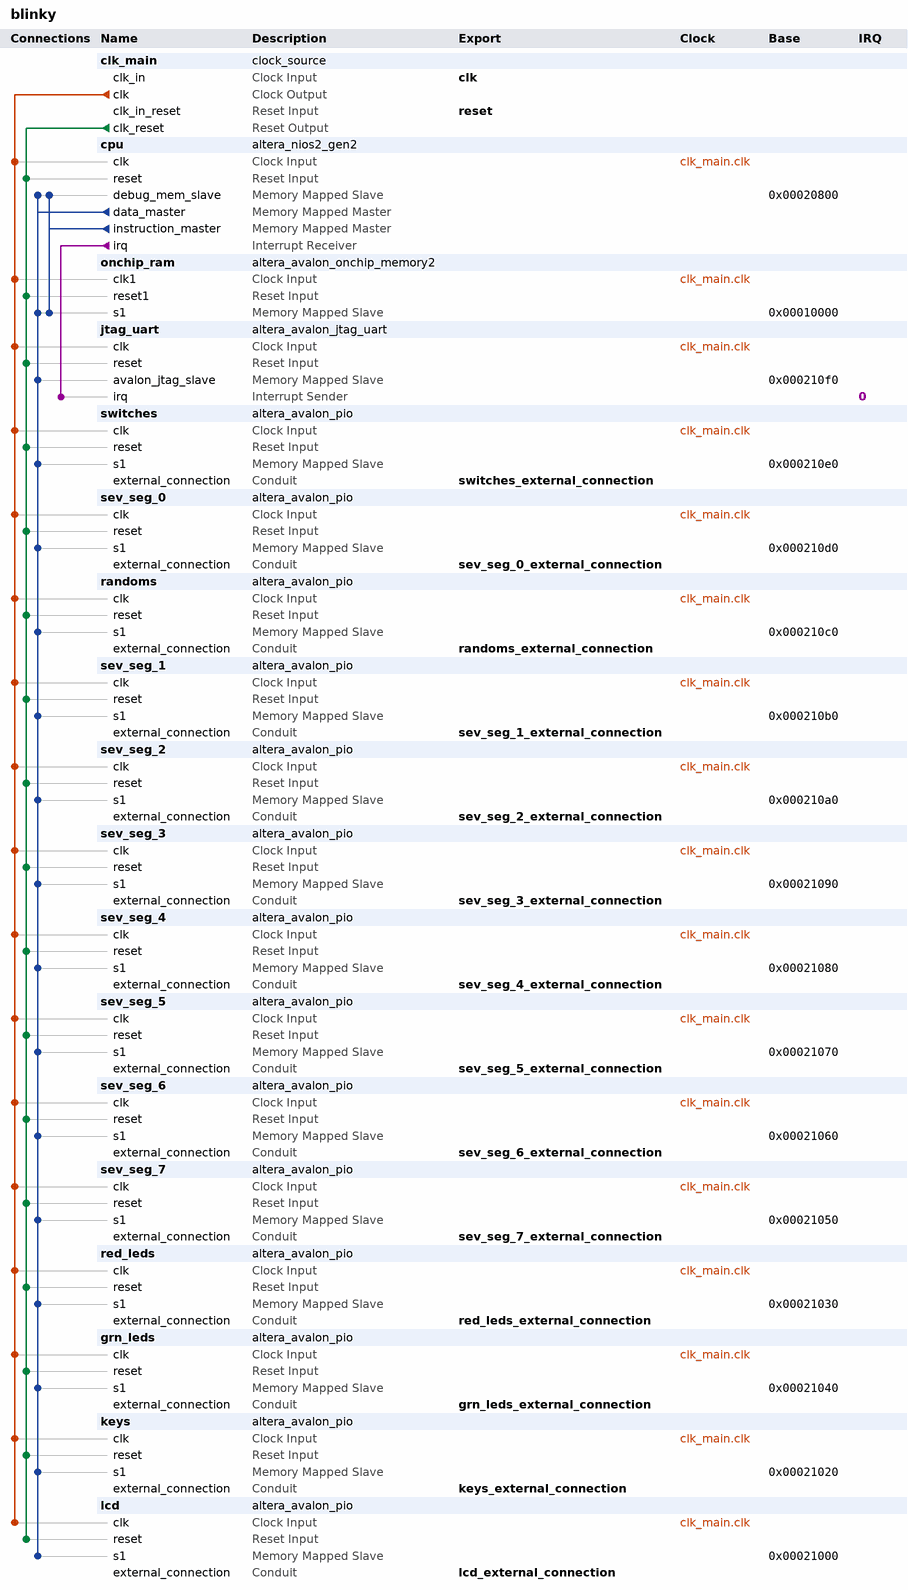
[diagram p0: system contents]
# Platform Designer (Qsys) system blinky, Cyclone IV E EP4CE115F29C7
# Parameters at their usual value, and those the tool derives, are not listed.
package require -exact qsys 18.0
create_system blinky
set_project_property DEVICE_FAMILY {Cyclone IV E}
set_project_property DEVICE EP4CE115F29C7

add_instance clk_main clock_source 18.0
set_instance_parameter_value clk_main clockFrequency 50000000

add_instance cpu altera_nios2_gen2 18.0
set_instance_parameter_value cpu dcache_size 2048
set_instance_parameter_value cpu exceptionSlave onchip_ram.s1
set_instance_parameter_value cpu icache_size 4096
set_instance_parameter_value cpu impl Tiny
set_instance_parameter_value cpu resetSlave onchip_ram.s1

add_instance onchip_ram altera_avalon_onchip_memory2 18.0
set_instance_parameter_value onchip_ram dataWidth 32
set_instance_parameter_value onchip_ram dualPort false
set_instance_parameter_value onchip_ram initMemContent false
set_instance_parameter_value onchip_ram initializationFileName onchip_mem.hex
set_instance_parameter_value onchip_ram memorySize 65536

add_instance jtag_uart altera_avalon_jtag_uart 18.0
set_instance_parameter_value jtag_uart simInteractiveOptions NO_INTERACTIVE_WINDOWS

add_instance switches altera_avalon_pio 18.0
set_instance_parameter_value switches direction Input
set_instance_parameter_value switches width 18

add_instance sev_seg_0 altera_avalon_pio 18.0
set_instance_parameter_value sev_seg_0 direction Output
set_instance_parameter_value sev_seg_0 width 7

add_instance randoms altera_avalon_pio 18.0
set_instance_parameter_value randoms direction Input
set_instance_parameter_value randoms width 32

add_instance sev_seg_1 altera_avalon_pio 18.0
set_instance_parameter_value sev_seg_1 direction Output
set_instance_parameter_value sev_seg_1 width 7

add_instance sev_seg_2 altera_avalon_pio 18.0
set_instance_parameter_value sev_seg_2 direction Output
set_instance_parameter_value sev_seg_2 width 7

add_instance sev_seg_3 altera_avalon_pio 18.0
set_instance_parameter_value sev_seg_3 direction Output
set_instance_parameter_value sev_seg_3 width 7

add_instance sev_seg_4 altera_avalon_pio 18.0
set_instance_parameter_value sev_seg_4 direction Output
set_instance_parameter_value sev_seg_4 width 7

add_instance sev_seg_5 altera_avalon_pio 18.0
set_instance_parameter_value sev_seg_5 direction Output
set_instance_parameter_value sev_seg_5 width 7

add_instance sev_seg_6 altera_avalon_pio 18.0
set_instance_parameter_value sev_seg_6 direction Output
set_instance_parameter_value sev_seg_6 width 7

add_instance sev_seg_7 altera_avalon_pio 18.0
set_instance_parameter_value sev_seg_7 direction Output
set_instance_parameter_value sev_seg_7 width 7

add_instance red_leds altera_avalon_pio 18.0
set_instance_parameter_value red_leds direction Output
set_instance_parameter_value red_leds width 17

add_instance grn_leds altera_avalon_pio 18.0
set_instance_parameter_value grn_leds direction Output
set_instance_parameter_value grn_leds width 8

add_instance keys altera_avalon_pio 18.0
set_instance_parameter_value keys direction Input
set_instance_parameter_value keys width 3

add_instance lcd altera_avalon_pio 18.0
set_instance_parameter_value lcd bitModifyingOutReg true
set_instance_parameter_value lcd direction Output
set_instance_parameter_value lcd width 13

# connections
add_connection clk_main.clk cpu.clk clock
add_connection clk_main.clk grn_leds.clk clock
add_connection clk_main.clk jtag_uart.clk clock
add_connection clk_main.clk keys.clk clock
add_connection clk_main.clk lcd.clk clock
add_connection clk_main.clk onchip_ram.clk1 clock
add_connection clk_main.clk randoms.clk clock
add_connection clk_main.clk red_leds.clk clock
add_connection clk_main.clk sev_seg_0.clk clock
add_connection clk_main.clk sev_seg_1.clk clock
add_connection clk_main.clk sev_seg_2.clk clock
add_connection clk_main.clk sev_seg_3.clk clock
add_connection clk_main.clk sev_seg_4.clk clock
add_connection clk_main.clk sev_seg_5.clk clock
add_connection clk_main.clk sev_seg_6.clk clock
add_connection clk_main.clk sev_seg_7.clk clock
add_connection clk_main.clk switches.clk clock
add_connection clk_main.clk_reset cpu.reset reset
add_connection clk_main.clk_reset grn_leds.reset reset
add_connection clk_main.clk_reset jtag_uart.reset reset
add_connection clk_main.clk_reset keys.reset reset
add_connection clk_main.clk_reset lcd.reset reset
add_connection clk_main.clk_reset onchip_ram.reset1 reset
add_connection clk_main.clk_reset randoms.reset reset
add_connection clk_main.clk_reset red_leds.reset reset
add_connection clk_main.clk_reset sev_seg_0.reset reset
add_connection clk_main.clk_reset sev_seg_1.reset reset
add_connection clk_main.clk_reset sev_seg_2.reset reset
add_connection clk_main.clk_reset sev_seg_3.reset reset
add_connection clk_main.clk_reset sev_seg_4.reset reset
add_connection clk_main.clk_reset sev_seg_5.reset reset
add_connection clk_main.clk_reset sev_seg_6.reset reset
add_connection clk_main.clk_reset sev_seg_7.reset reset
add_connection clk_main.clk_reset switches.reset reset
add_connection cpu.data_master cpu.debug_mem_slave avalon
set_connection_parameter_value cpu.data_master/cpu.debug_mem_slave baseAddress 0x00020800
add_connection cpu.data_master grn_leds.s1 avalon
set_connection_parameter_value cpu.data_master/grn_leds.s1 baseAddress 0x00021040
add_connection cpu.data_master jtag_uart.avalon_jtag_slave avalon
set_connection_parameter_value cpu.data_master/jtag_uart.avalon_jtag_slave baseAddress 0x000210f0
add_connection cpu.data_master keys.s1 avalon
set_connection_parameter_value cpu.data_master/keys.s1 baseAddress 0x00021020
add_connection cpu.data_master lcd.s1 avalon
set_connection_parameter_value cpu.data_master/lcd.s1 baseAddress 0x00021000
add_connection cpu.data_master onchip_ram.s1 avalon
set_connection_parameter_value cpu.data_master/onchip_ram.s1 baseAddress 0x00010000
add_connection cpu.data_master randoms.s1 avalon
set_connection_parameter_value cpu.data_master/randoms.s1 baseAddress 0x000210c0
add_connection cpu.data_master red_leds.s1 avalon
set_connection_parameter_value cpu.data_master/red_leds.s1 baseAddress 0x00021030
add_connection cpu.data_master sev_seg_0.s1 avalon
set_connection_parameter_value cpu.data_master/sev_seg_0.s1 baseAddress 0x000210d0
add_connection cpu.data_master sev_seg_1.s1 avalon
set_connection_parameter_value cpu.data_master/sev_seg_1.s1 baseAddress 0x000210b0
add_connection cpu.data_master sev_seg_2.s1 avalon
set_connection_parameter_value cpu.data_master/sev_seg_2.s1 baseAddress 0x000210a0
add_connection cpu.data_master sev_seg_3.s1 avalon
set_connection_parameter_value cpu.data_master/sev_seg_3.s1 baseAddress 0x00021090
add_connection cpu.data_master sev_seg_4.s1 avalon
set_connection_parameter_value cpu.data_master/sev_seg_4.s1 baseAddress 0x00021080
add_connection cpu.data_master sev_seg_5.s1 avalon
set_connection_parameter_value cpu.data_master/sev_seg_5.s1 baseAddress 0x00021070
add_connection cpu.data_master sev_seg_6.s1 avalon
set_connection_parameter_value cpu.data_master/sev_seg_6.s1 baseAddress 0x00021060
add_connection cpu.data_master sev_seg_7.s1 avalon
set_connection_parameter_value cpu.data_master/sev_seg_7.s1 baseAddress 0x00021050
add_connection cpu.data_master switches.s1 avalon
set_connection_parameter_value cpu.data_master/switches.s1 baseAddress 0x000210e0
add_connection cpu.instruction_master cpu.debug_mem_slave avalon
set_connection_parameter_value cpu.instruction_master/cpu.debug_mem_slave baseAddress 0x00020800
add_connection cpu.instruction_master onchip_ram.s1 avalon
set_connection_parameter_value cpu.instruction_master/onchip_ram.s1 baseAddress 0x00010000
add_connection cpu.irq jtag_uart.irq interrupt
set_connection_parameter_value cpu.irq/jtag_uart.irq irqNumber 0

# exported interfaces
add_interface clk clock sink
set_interface_property clk EXPORT_OF clk_main.clk_in
add_interface grn_leds_external_connection conduit end
set_interface_property grn_leds_external_connection EXPORT_OF grn_leds.external_connection
add_interface keys_external_connection conduit end
set_interface_property keys_external_connection EXPORT_OF keys.external_connection
add_interface lcd_external_connection conduit end
set_interface_property lcd_external_connection EXPORT_OF lcd.external_connection
add_interface randoms_external_connection conduit end
set_interface_property randoms_external_connection EXPORT_OF randoms.external_connection
add_interface red_leds_external_connection conduit end
set_interface_property red_leds_external_connection EXPORT_OF red_leds.external_connection
add_interface reset reset sink
set_interface_property reset EXPORT_OF clk_main.clk_in_reset
add_interface sev_seg_0_external_connection conduit end
set_interface_property sev_seg_0_external_connection EXPORT_OF sev_seg_0.external_connection
add_interface sev_seg_1_external_connection conduit end
set_interface_property sev_seg_1_external_connection EXPORT_OF sev_seg_1.external_connection
add_interface sev_seg_2_external_connection conduit end
set_interface_property sev_seg_2_external_connection EXPORT_OF sev_seg_2.external_connection
add_interface sev_seg_3_external_connection conduit end
set_interface_property sev_seg_3_external_connection EXPORT_OF sev_seg_3.external_connection
add_interface sev_seg_4_external_connection conduit end
set_interface_property sev_seg_4_external_connection EXPORT_OF sev_seg_4.external_connection
add_interface sev_seg_5_external_connection conduit end
set_interface_property sev_seg_5_external_connection EXPORT_OF sev_seg_5.external_connection
add_interface sev_seg_6_external_connection conduit end
set_interface_property sev_seg_6_external_connection EXPORT_OF sev_seg_6.external_connection
add_interface sev_seg_7_external_connection conduit end
set_interface_property sev_seg_7_external_connection EXPORT_OF sev_seg_7.external_connection
add_interface switches_external_connection conduit end
set_interface_property switches_external_connection EXPORT_OF switches.external_connection

set_interconnect_requirement {$system} qsys_mm.clockCrossingAdapter HANDSHAKE
set_interconnect_requirement {$system} qsys_mm.enableEccProtection FALSE
set_interconnect_requirement {$system} qsys_mm.insertDefaultSlave FALSE
set_interconnect_requirement {$system} qsys_mm.maxAdditionalLatency 1

save_system blinky.qsys
